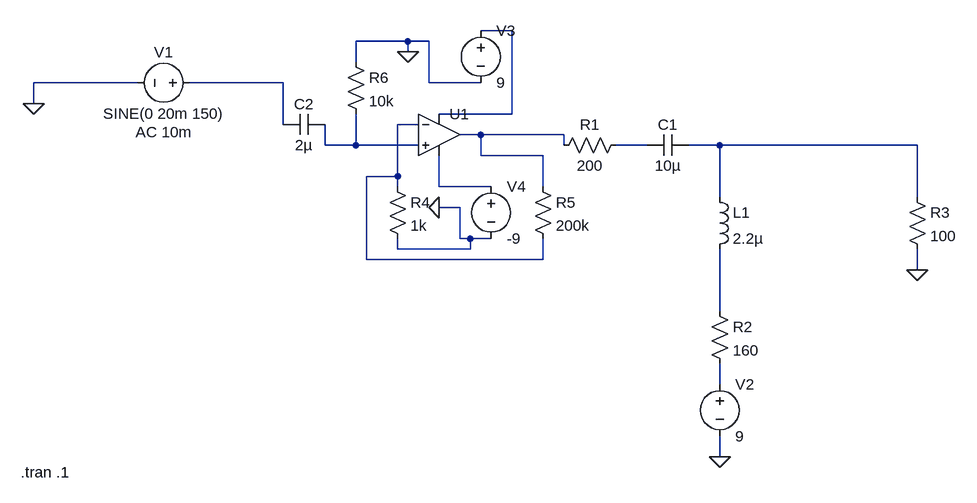
[diagram p0: schematic Amplifier_and_bias-t.asc]
Amplifier_and_bias-t.asc, the LTspice schematic file:
Version 4
SHEET 1 1532 680
WIRE 400 -304 352 -304
WIRE 240 -288 160 -288
WIRE 272 -288 240 -288
WIRE 240 -272 240 -288
WIRE 160 -256 160 -288
WIRE -176 -224 -336 -224
WIRE 48 -224 -96 -224
WIRE 272 -224 272 -288
WIRE 352 -224 272 -224
WIRE -336 -192 -336 -224
WIRE 400 -176 400 -304
WIRE 400 -176 288 -176
WIRE 48 -160 48 -224
WIRE 256 -160 224 -160
WIRE 352 -144 320 -144
WIRE 480 -144 352 -144
WIRE 112 -128 112 -160
WIRE 160 -128 160 -176
WIRE 160 -128 112 -128
WIRE 256 -128 160 -128
WIRE 480 -128 480 -144
WIRE 608 -128 560 -128
WIRE 720 -128 672 -128
WIRE 1024 -128 720 -128
WIRE 352 -112 352 -144
WIRE 448 -112 352 -112
WIRE 224 -80 224 -160
WIRE 224 -80 176 -80
WIRE 224 -64 224 -80
WIRE 288 -64 288 -112
WIRE 368 -64 288 -64
WIRE 448 -64 448 -112
WIRE 720 -48 720 -128
WIRE 1024 -48 1024 -128
WIRE 320 -32 288 -32
WIRE 320 16 320 -32
WIRE 336 16 320 16
WIRE 368 16 336 16
WIRE 224 32 224 16
WIRE 336 32 336 16
WIRE 336 32 224 32
WIRE 176 48 176 -80
WIRE 448 48 448 16
WIRE 448 48 176 48
WIRE 1024 64 1024 32
WIRE 720 128 720 32
WIRE 720 240 720 208
WIRE 720 352 720 320
FLAG 1024 64 0
FLAG -336 -192 0
FLAG 240 -272 0
FLAG 288 -32 0
FLAG 720 352 0
SYMBOL voltage -80 -224 R90
WINDOW 0 -32 56 VBottom 2
WINDOW 3 32 56 VTop 2
WINDOW 123 60 56 VTop 2
WINDOW 39 0 0 Left 2
SYMATTR InstName V1
SYMATTR Value SINE(0 20m 150)
SYMATTR Value2 AC 10m
SYMBOL res 464 -112 R270
WINDOW 0 32 56 VTop 2
WINDOW 3 0 56 VBottom 2
SYMATTR InstName R1
SYMATTR Value 200
SYMBOL cap 608 -112 R270
WINDOW 0 32 32 VTop 2
WINDOW 3 0 32 VBottom 2
SYMATTR InstName C1
SYMATTR Value 10µ
SYMBOL ind 704 -64 R0
SYMATTR InstName L1
SYMATTR Value 2.2µ
SYMBOL res 1008 -64 R0
SYMATTR InstName R3
SYMATTR Value 100
SYMBOL Opamps\\UniversalOpamp2 288 -144 R0
SYMATTR InstName U1
SYMBOL voltage 352 -320 R0
WINDOW 123 0 0 Left 2
WINDOW 39 0 0 Left 2
SYMATTR InstName V3
SYMATTR Value 9
SYMBOL voltage 368 -80 R0
WINDOW 123 0 0 Left 2
WINDOW 39 0 0 Left 2
SYMATTR InstName V4
SYMATTR Value -9
SYMBOL res 208 -80 R0
SYMATTR InstName R4
SYMATTR Value 1k
SYMBOL cap 48 -144 R270
WINDOW 0 32 32 VTop 2
WINDOW 3 0 32 VBottom 2
SYMATTR InstName C2
SYMATTR Value 2µ
SYMBOL res 144 -272 R0
SYMATTR InstName R6
SYMATTR Value 10k
SYMBOL res 432 -80 R0
SYMATTR InstName R5
SYMATTR Value 200k
SYMBOL voltage 720 224 R0
WINDOW 123 0 0 Left 2
WINDOW 39 0 0 Left 2
SYMATTR InstName V2
SYMATTR Value 9
SYMBOL res 704 112 R0
SYMATTR InstName R2
SYMATTR Value 160
TEXT -356 376 Left 2 !.tran .1

The netlist it stands for:
* Amplifier_and_bias-t.asc
V1 N002 0 SINE(0 20m 150) AC 10m
R1 N004 N006 200
C1 N006 N007 10µ
L1 N007 N009 2.2µ
R3 N007 0 100
XU1 N005 N003 N001 N008 N004 level.2 Avol=1Meg GBW=10Meg Slew=10Meg ilimit=25m rail=0 Vos=0 phimargin=45 en=0 enk=0 in=0 ink=0 Rin=500Meg  ; pins IN+ IN- V+ V- OUT
V3 N001 0 9
V4 N008 0 -9
R4 N003 0 1k
C2 N002 N005 2µ
R6 0 N005 10k
R5 N004 N003 200k
V2 N010 0 9
R2 N009 N010 160
.tran .1
.lib UniversalOpamps2.sub
.backanno
.end